# EAGLE design stampede-board (EAGLE 7.7.0)
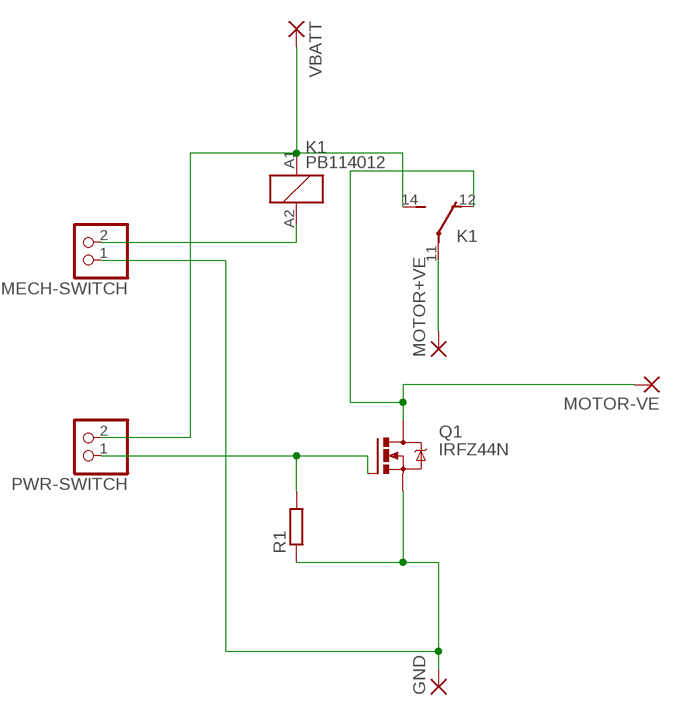
[diagram p0: schematic, sheet 1]

## Parts
GND  WIREPAD3,17/1,3  [3,17/1,3]
K1  PB114012  [PB]
MECH-SWITCH  PINHD-1X2  [1X02]
MOTOR+VE  WIREPAD3,17/1,3  [3,17/1,3]
MOTOR-VE  WIREPAD3,17/1,3  [3,17/1,3]
PWR-SWITCH  PINHD-1X2  [1X02]
Q1  IRFZ44N  IRF520  [TO220BV]
R1  R-EU_0207/7  [0207/7]
VBATT  WIREPAD3,17/1,3  [3,17/1,3]

## Nets
GATE: PWR-SWITCH.1 Q1.G R1.2
GND: GND.1(P) MECH-SWITCH.1 Q1.S R1.1
MOTOR+VE: K1.11(2:P) MOTOR+VE.1(P)
MOTOR-VE: K1.12(2:O) MOTOR-VE.1(P) Q1.D
N$4: K1.A2 MECH-SWITCH.2
VBATT: K1.14(2:S) K1.A1 PWR-SWITCH.2 VBATT.1(P)

## Library data of the parts
GND MOTOR+VE MOTOR-VE VBATT = wirepad:WIREPAD: Wire PAD connect wire on PCB
K1 = relay:PB?14*: Miniature Power PCB Relay SCHRACK 1pole 10 A Source: http://www.schrack.com/.. 5846.pdf; MF: TYCO ELECTRONICS; MPN: PB114012; OC_FARNELL: 1175077; OC_NEWARK: 34K8593
MECH-SWITCH PWR-SWITCH = pinhead:PINHD-1X2: PIN HEADER
Q1 = transistor-power:IRF520: HEXFET Power MOSFET
R1 = rcl:R-EU_: RESISTOR, European symbol

## Board
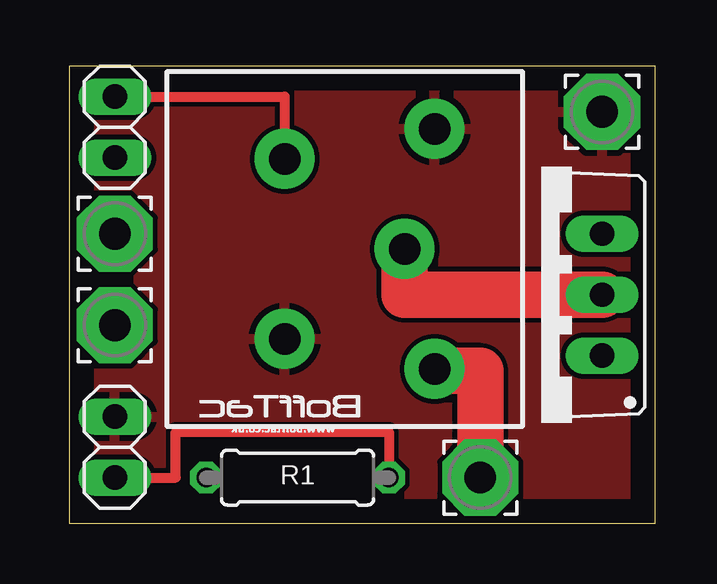
[diagram p1: board, top side]
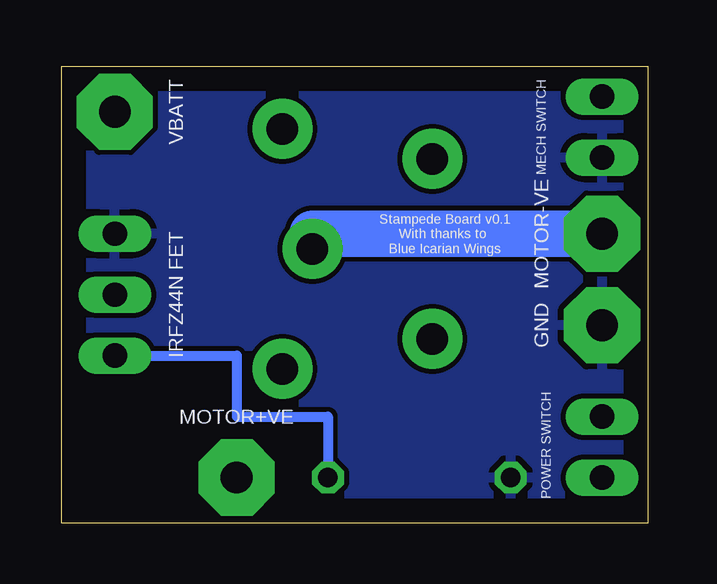
[diagram p2: board, bottom side, seen from below]

Size 24.43 x 19.04 mm. Coordinates in mm from the lower left corner, seen from the top.
Outline: 0,0 24.43,0 24.43,19.04 0,19.04 0,0
Copper layers (1*16): Top 0.035mm / dielectric 1.5mm / Bottom 0.035mm
Design rules "default": minimum track width 10mil, minimum drill 24mil, track to track 8mil, track to pad 8mil, pad to pad 8mil, via to via 8mil, smd to smd 8mil, copper to edge 40mil, drill to drill 8mil, minimum pad ring 10mil, minimum via ring 8mil, stop-mask expansion 4mil, vias tented up to drill 0mil, thermal gap 10mil

### Footprints (pad centres in the part's own frame; a part is rotated, then mirrored left to right if it is on the bottom)
3,17/1,3 = drill 1.321 pad 3.175 octagon: 1 0,0
PB = drill 1.3 pad 2.5: 11 3.81,-5; 12 2.56,0; 14 3.81,5; A1 -2.44,-3.75; A2 -2.44,3.75
1X02 = drill 1.016 long: 1 -1.27,0; 2 1.27,0
TO220BV = drill 1.016 long: D 0,-2.54; G -2.54,-2.54; S 2.54,-2.54
0207/7 = drill 0.813 octagon: 1 -3.81,0; 2 3.81,0

### Placement (x,y rotation side)
GND  1.91,8.26 0 top
K1  11.43,11.43 0 top
MECH-SWITCH  1.91,16.51 90 top
MOTOR+VE  17.14,1.91 0 top
MOTOR-VE  1.91,12.06 0 top
PWR-SWITCH  1.91,3.17 90 top
Q1  19.68,9.53 90 top
R1  9.53,1.91 0 top
VBATT  22.23,17.14 0 top

### Tracks (layer width: path | path; a pad name or v marks a point on that pad's centre or on a via)
GATE
  Top 0.406: PWR-SWITCH.1 4.45,1.91 4.45,3.81 13.34,3.81 R1.2
  Bottom 0.406: Q1.G 17.14,6.99 17.14,4.45 13.34,4.45 R1.2
GND
  pour Bottom: 0,19.05 24.13,19.05 24.13,0 0,0
MOTOR+VE
  Top 1.93: MOTOR+VE.1 17.14,6.35 15.24,6.35 K1.11
MOTOR-VE
  Top 1.93: Q1.D 13.99,9.53 K1.12
  Bottom 1.93: MOTOR-VE.1 13.99,12.06 K1.12
N$4
  Top 0.406: MECH-SWITCH.2 8.99,17.78 K1.A2
VBATT
  pour Top: 0,19.05 24.13,19.05 24.13,0 0,0

### Text on the board
bNames: MECH SWITCH | VBATT | MOTOR-VE | Stampede Board v0.1 / With thanks to / Blue Icarian Wings | IRFZ44N FET | GND | MOTOR+VE | POWER SWITCH | Y:/BoffTac/Logo/monologo-w-address.bmp